# Altium project Isolated Gate Driver Bias Supply.PrjPcb
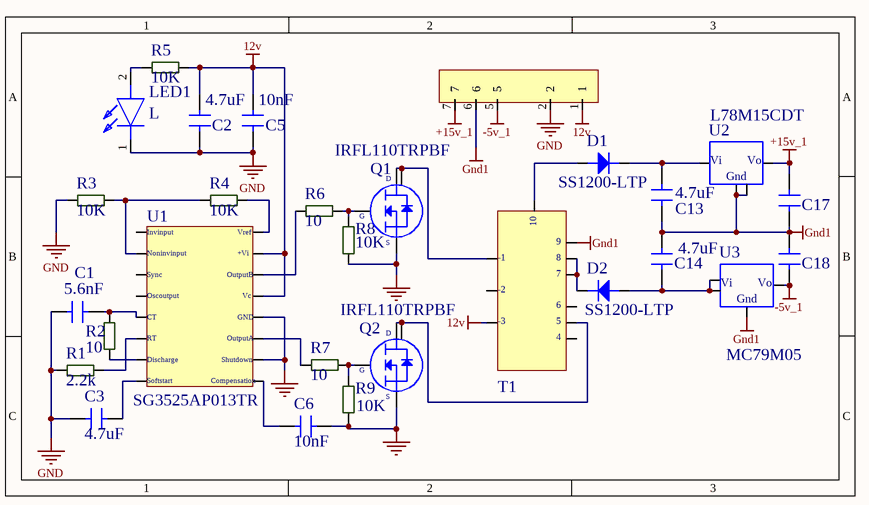
[diagram p0: Isolated Gate Driver Bias Supply Schematic.SchDoc]
1 sheet, 28 parts. Net scope: global (net labels, ports and power ports of the same name join across sheets).
Board file: Isolated Gate Driver Bias Supply PCB.PcbDoc

## Sheet Isolated Gate Driver Bias Supply Schematic.SchDoc
size 160 x 90 mm

### Parts
7  7  [SIP7]  (value not drawn)
C1  5.6nF  [Cap1206]
C2  4.7uF  [Cap1206]
C3  4.7uF  [Cap1206]
C5  10nF  [Cap1206]
C6  10nF  [Cap1206]
C13  4.7uF  [Cap1206]
C14  4.7uF  [Cap1206]
C17  CL31A106KBHNNNE  [Cap1206]  (value not drawn)
C18  CL31A106KBHNNNE  [Cap1206]  (value not drawn)
D1  SS1200-LTP  [DO-214AC]
D2  SS1200-LTP  [DO-214AC]
LED1  L  [L-1206]
Q1  IRFL110TRPBF  [SOT223]
Q2  IRFL110TRPBF  [SOT223]
R1  2.2k  [RES1206]
R2  10  [RES1206]
R3  10K  [RES1206]
R4  10K  [RES1206]
R5  10K  [RES1206]
R6  10  [RES1206]
R7  10  [RES1206]
R8  10K  [RES1206]
R9  10K  [RES1206]
T1  EE2006Transformer  [EE2006]  (value not drawn)
U1  SG3525AP013TR  [SOIC16N SG3525]
U2  L78M15CDT  [sot89]
U3  MC79M05  [sot89]

### Nets
12v: 7.1 C2.1 C5.1 R5.1 T1.3 U1.13 U1.15
+15v_1: 7.7 C17.1 U2.1
-5v_1: 7.5 C18.2 U3.3
GND: 7.2 C1.2 C2.2 C3.1 C5.2 C6.1 LED1.1(K) Q1.3 Q2.3 R1.1 R3.2 R8.1 R9.2 U1.10 U1.12
Gnd1: 7.6 C13.2 C14.1 C17.2 C18.1 T1.9 U2.2 U2.4 U3.1
NetC1_1: C1.1 R2.1 U1.5
NetC3_2: C3.2 U1.8
NetC6_2: C6.2 U1.9
NetC13_1: C13.1 D1.k U2.3
NetC14_2: C14.2 D2.a U3.2
NetD1_a: D1.a T1.10
NetD2_k: D2.k T1.7 T1.8
NetLED1_2: LED1.2(A) R5.2
NetQ1_1: Q1.1 R6.1 R8.2
NetQ1_2: Q1.2 Q1.4 T1.1
NetQ2_1: Q2.1 R7.1 R9.1
NetQ2_2: Q2.2 Q2.4 T1.5
NetR1_2: R1.2 U1.6
NetR2_2: R2.2 U1.7
NetR3_1: R3.1 R4.2 U1.2
NetR4_1: R4.1 U1.16
NetR6_2: R6.2 U1.14
NetR7_2: R7.2 U1.11

Not connected (* = marked no-connect by the designer): T1 2 4 6; U1 1 3 4

### Notes on the sheet
- Title
- Size:
- Date:
- A
- Number:
- Time:
- Revision:
- Sheet
- of
- File:
- (in symbol EE2006Transformer) -1; -2; -3
- (in symbol IRFL110TRPBF) Text; D; G; S
- (in symbol L78M15CDT) Vi; Vo; Gnd
- (in symbol MC79M05CDTRKG) Vi; Vo; Gnd
- (in symbol SG3525AP013TR) Invinput; Vref; Noninvinput; +Vi; Sync; OutputB; Oscoutput; Vc; CT; GND; RT; OutputA; Discharge; Shutdown; Softstart; Compensation

### Library data of the parts
7 = sip7
C1-C3 C5 C6 C13 C14 C17 C18 = CL31A106KBHNNNE: Cap Ceramic 10uF 50V X5R 10% SMD 1206 85C T/R; Manufacturer: Samsung; Supplier 1: Digi-Key; Manufacturer Part Number: CL31A106KBHNNNE; RoHS: Yes; Stock 1: 482000; Pricing 1: 2000 = 0,17875, 4000 = 0,16758 (USD); Mount: Surface Mount; Case/Package: 1206; Case Code (Metric): 3216; Case Code (Imperial): 1206; Material: Ceramic; Contact Plating: Tin; Min Operating Temperature: -55°C; Max Operating Temperature: 85°C; Capacitance: 10uF; Tolerance: 10%; Package Quantity: 1; Packaging: Tape and Reel; Voltage Rating: 50V; Dielectric: X5R; Voltage Rating (DC): 50V; Length: 3.2mm; Height: 1.6mm; Width: 0.063inch; Thickness: 0.071inch; Depth: 1.6mm; Radiation Hardening: No; Lead Free: Lead Free; ComponentLink1URL: https://media.digikey.com/pdf/Data%20Sheets/Samsung%20PDFs/CL_Series_MLCC_ds.pdf?src-supplier=Digi-Key; ComponentLink1Description: https://media.digikey.com/pdf/Data%20Sheets/Samsung%20PDFs/CL_Series_MLCC_ds.pdf?src-supplier=Digi-Key; ComponentLink2URL: http://www1.futureelectronics.com/doc/SAMSUNG%20PASSIVE/CL05B104KQ5NNNC.pdf?src-supplier=Future+Electronics; ComponentLink2Description: http://www1.futureelectronics.com/doc/SAMSUNG%20PASSIVE/CL05B104KQ5NNNC.pdf?src-supplier=Future+Electronics; ComponentLink3URL: http://www.rapidonline.com/pdf/71-0881.pdf?src-supplier=Rapid+Electronics; ComponentLink3Description: http://www.rapidonline.com/pdf/71-0881.pdf?src-supplier=Rapid+Electronics; ComponentLink4URL: https://www.verical.com/server-webapp/html/getDatasheet?partID=353196&src-supplier=Verical; ComponentLink4Description: https://www.verical.com/server-webapp/html/getDatasheet?partID=353196&src-supplier=Verical; ComponentLink5URL: https://produktinfo.conrad.com/datenblaetter/450000-474999/452492-da-01-en-VS_KONDENSATOR_1206.pdf?src-supplier=Conrad; ComponentLink5Description: https://produktinfo.conrad.com/datenblaetter/450000-474999/452492-da-01-en-VS_KONDENSATOR_1206.pdf?src-supplier=Conrad; Supplier Part Number 1: 1276-2876-2-ND
D1 D2 = SS1200-LTP: DIODE SCHOTTKY 200V 1A DO214AC; Manufacturer: MCC; Max Surge Current: 30A; Forward Voltage: 920mV; Peak Reverse Current: 1mA; Element Configuration: Single; Supplier 1: Digi-Key; Manufacturer Part Number: SS1200-LTP; RoHS: Yes; Stock 1: 10000; Pricing 1: 5000 = 0,09300, 10000 = 0,08700, 25000 = 0,08400 (USD); Mount: Surface Mount; Min Operating Temperature: -55°C; Max Operating Temperature: 150°C; Packaging: Tape and Reel; Package Quantity: 1; Max Reverse Leakage Current: 1mA; Max Repetitive Reverse Voltage (Vrrm): 200V; Forward Current: 1A; Max Forward Surge Current (Ifsm): 30A; Average Rectified Current: 1A; Max Reverse Voltage (DC): 200V; Lead Free: Lead Free; ComponentLink1URL: https://datasheet.ciiva.com/913/ss1150-l-ss1200-ldo-214ac-913194.pdf?src-supplier=Digi-Key; ComponentLink1Description: https://datasheet.ciiva.com/913/ss1150-l-ss1200-ldo-214ac-913194.pdf?src-supplier=Digi-Key; ComponentLink2URL: https://datasheet.ciiva.com/15404/ss1150-l-ss1200-ldo-214ac-272760-15404740.pdf?src-supplier=Mouser; ComponentLink2Description: https://datasheet.ciiva.com/15404/ss1150-l-ss1200-ldo-214ac-272760-15404740.pdf?src-supplier=Mouser; ComponentLink3URL: https://datasheet.ciiva.com/913/ss1150-l-ss1200-ldo-214ac-913195.pdf?src-supplier=Digi-Key; ComponentLink3Description: https://datasheet.ciiva.com/913/ss1150-l-ss1200-ldo-214ac-913195.pdf?src-supplier=Digi-Key; ComponentLink4URL: https://datasheet.ciiva.com/913/ss1150-l-ss1200-ldo-214ac-913196.pdf?src-supplier=Digi-Key; ComponentLink4Description: https://datasheet.ciiva.com/913/ss1150-l-ss1200-ldo-214ac-913196.pdf?src-supplier=Digi-Key; ComponentLink5URL: https://datasheet.ciiva.com/17447/ss1150-l-ss1200-ldo-214ac-17447695.pdf?src-supplier=Future+Electronics; ComponentLink5Description: https://datasheet.ciiva.com/17447/ss1150-l-ss1200-ldo-214ac-17447695.pdf?src-supplier=Future+Electronics; Supplier Part Number 1: SS1200-LTPMSTR-ND
LED1 = LTST-C150KGKT: LED; Manufacturer_Name: Lite-On; Datasheet Link: http://optoelectronics.liteon.com/upload/download/ds22-2000-072/ltst-c150kgkt.pdf; Height: 1.2mm; Manufacturer_Part_Number: LTST-C150KGKT; Mouser Part Number: 859-LTST-C150KGKT; Mouser Price/Stock: https://www.mouser.com/Search/Refine.aspx?Keyword=859-LTST-C150KGKT; RS Part Number: 6920871; RS Price/Stock: https://uk.rs-online.com/web/p/products/6920871
Q1 Q2 = IRFL110TRPBF: Trans MOSFET N-CH 100V 1.5A 4-Pin(3+Tab) T/R; Manufacturer: Vishay; Input Capacitance: 180pF; Number of Elements: 1; Max Power Dissipation: 2W; Rds On Max: 540mR; Rise Time: 16ns; Gate to Source Voltage (Vgs): 20V; Fall Time: 9.4ns; Turn-Off Delay Time: 15ns; Turn-On Delay Time: 6.9ns; Element Configuration: Single; Current: 15A; Supplier 1: Digi-Key; Manufacturer Part Number: IRFL110TRPBF; RoHS: Yes; Stock 1: 5000; Pricing 1: 2500 = 0,29779 (USD); Mount: Surface Mount; Case/Package: SOT-223; Number of Pins: 3; Weight: 0.008826oz; Contact Plating: Matte,Tin; Min Operating Temperature: -55°C; Max Operating Temperature: 150°C; Package Quantity: 1; Packaging: Tape and Reel; Drain to Source Voltage (Vdss): 100V; Continuous Drain Current (ID): 1.5A; Drain to Source Breakdown Voltage: 100V; Drain to Source Resistance: 540mR; Power Dissipation: 2W; Number of Channels: 1; Voltage: 100V; On-State Resistance: 540mR; Length: 6.7mm; Height: 1.8mm; Width: 3.7mm; Radiation Hardening: No; REACH SVHC: Unknown; Lead Free: Lead Free; ComponentLink1URL: http://www.vishay.com/docs/91192/sihfl110.pdf?src-supplier=Avnet; ComponentLink1Description: http://www.vishay.com/docs/91192/sihfl110.pdf?src-supplier=Avnet; ComponentLink2URL: http://www.vishay.com/docs/91192/sihfl110.pdf?src-supplier=Future+Electronics; ComponentLink2Description: http://www.vishay.com/docs/91192/sihfl110.pdf?src-supplier=Future+Electronics; ComponentLink3URL: http://www.vishay.com/docs/91192/sihfl110.pdf?src-supplier=Avnet+Europe; ComponentLink3Description: http://www.vishay.com/docs/91192/sihfl110.pdf?src-supplier=Avnet+Europe; ComponentLink4URL: https://www.verical.com/server-webapp/html/getDatasheet?partID=80948&src-supplier=Verical; ComponentLink4Description: https://www.verical.com/server-webapp/html/getDatasheet?partID=80948&src-supplier=Verical; ComponentLink5URL: http://www.vishay.com/docs/91192/sihfl110.pdf?src-supplier=Digi-Key; ComponentLink5Description: http://www.vishay.com/docs/91192/sihfl110.pdf?src-supplier=Digi-Key; ComponentLink6URL: http://uk.rs-online.com/webdocs/126c/0900766b8126cec6.pdf?src-supplier=RSComponents; ComponentLink6Description: http://uk.rs-online.com/webdocs/126c/0900766b8126cec6.pdf?src-supplier=RSComponents; ComponentLink7URL: http://www.jameco.com/Jameco/Products/ProdDS/1562152.pdf?src-supplier=Jameco; ComponentLink7Description: http://www.jameco.com/Jameco/Products/ProdDS/1562152.pdf?src-supplier=Jameco; ComponentLink8URL: http://datasheet.iiic.cc/vishay_[siliconix]/IRFL110TRPBF.pdf?src-supplier=IIIC; ComponentLink8Description: http://datasheet.iiic.cc/vishay_[siliconix]/IRFL110TRPBF.pdf?src-supplier=IIIC; Supplier Part Number 1: IRFL110PBFTR-ND
R1-R9 = RMCF1206ZT0R00: RES 0 OHM JUMPER 1/4W 1206; Manufacturer: Stackpole Electronics; Resistance: 0mR; Power Rating: 250mW; Current Rating: 2A; Working Voltage: 200V; Supplier 1: Digi-Key; Manufacturer Part Number: RMCF1206ZT0R00; RoHS: Yes; Stock 1: 1700000; Pricing 1: 5000 = 0,00355, 10000 = 0,00309, 25000 = 0,00271, 50000 = 0,00249, 125000 = 0,00244 (USD); Mount: Surface Mount; Case/Package: 1206; Case Code (Metric): 3216; Case Code (Imperial): 1206; Contact Plating: Matte,Tin; Min Operating Temperature: -55°C; Max Operating Temperature: 155°C; Packaging: Tape and Reel; Composition: Thick Film; Number of Terminations: 2; Military Standard: Not; Max Power Dissipation: 250mW; Features: Automotive AEC-Q200; Length: 0.126inch; Height: 0.028inch; Width: 0.063inch; Depth: 1.6mm; Radiation Hardening: No; Lead Free: Lead Free; Supplier Part Number 1: RMCF1206ZT0R00TR-ND
U1 = SG3525AP013TR: IC REG CTRLR BCK/PSH-PULL 16SOIC; Manufacturer: STMicroelectronics; Max Supply Voltage: 35V; Output Current: 400A; Rise Time: 100ns; Number of Outputs: 2; Switching Frequency: 400kHz; Output Voltage: 5.2V; Max Frequency: 500kHz; Duty Cycle: 49%; Fall Time: 50ns; Operating Supply Current: 14mA; Max Supply Current: 20mA; Supplier 1: Digi-Key; RoHS: Yes; Stock 1: 5712; Pricing 1: 1 = 1,58000, 10 = 1,41600, 100 = 1,10400, 500 = 0,91196, 1000 = 0,71997 (USD); Mount: Surface Mount; Number of Pins: 16; Weight: 0.007079oz; Min Operating Temperature: 0°C; Max Operating Temperature: 70°C; Packaging: Tape and Reel; Package Quantity: 1; Max Duty Cycle: 49%; Radiation Hardening: No; Lead Free: Lead Free; ComponentLink1URL: http://www.st.com/content/ccc/resource/technical/document/datasheet/c0/12/98/4a/3b/1a/4b/8b/CD00000958.pdf/files/CD00000958.pdf/jcr:content/translations/en.CD00000958.pdf?src-supplier=Digi-Key; ComponentLink1Description: http://www.st.com/content/ccc/resource/technical/document/datasheet/c0/12/98/4a/3b/1a/4b/8b/CD00000958.pdf/files/CD00000958.pdf/jcr:content/translations/en.CD00000958.pdf?src-supplier=Digi-Key; ComponentLink2URL: https://www.verical.com/server-webapp/html/getDatasheet?partID=376579&src-supplier=Verical; ComponentLink2Description: https://www.verical.com/server-webapp/html/getDatasheet?partID=376579&src-supplier=Verical; ComponentLink3URL: http://www.produktinfo.conrad.com/datenblaetter/1100000-1199999/001185611-da-01-en-IC_REG_CTRLR_P_SG3525AP013TR_SOIC_16_STM.pdf?src-supplier=Conrad; ComponentLink3Description: http://www.produktinfo.conrad.com/datenblaetter/1100000-1199999/001185611-da-01-en-IC_REG_CTRLR_P_SG3525AP013TR_SOIC_16_STM.pdf?src-supplier=Conrad; Case/Package: SOIC; Supplier Part Number 1: 497-6479-1-ND; Manufacturer Part Number: SG3525AP013TR
U2 = L78M15CDT: Linear Voltage Regulators 15V 0.5A Positive; Manufacturer: STMicroelectronics; Max Output Current: 500mA; Number of Outputs: 1; Max Input Voltage: 35V; Quiescent Current: 6mA; Output Type: Fixed; Dropout Voltage: 2V; Supplier 1: Avnet; Manufacturer Part Number: L78M15CDT; RoHS: Yes; Mount: Surface Mount; Case/Package: DPAK; Number of Pins: 3; Min Operating Temperature: 0°C; Max Operating Temperature: 150°C; Output Voltage: 15V; Polarity: Positive; Packaging: Rail/Tube; Output Current: 500mA; Min Input Voltage: 35V; Package Quantity: 75; Length: 6.6mm; Height: 2.4mm; Width: 6.2mm; Radiation Hardening: No; ComponentLink1URL: http://docs-usa.electrocomponents.com/techlib:/itc_doclist_US.htm?stockno=1890999&src-supplier=Allied+Electronics; ComponentLink1Description: http://docs-usa.electrocomponents.com/techlib:/itc_doclist_US.htm?stockno=1890999&src-supplier=Allied+Electronics; ComponentLink2URL: http://www.st.com/web/en/resource/technical/document/datasheet/CD00000447.pdf?src-supplier=Avnet+Europe; ComponentLink2Description: http://www.st.com/web/en/resource/technical/document/datasheet/CD00000447.pdf?src-supplier=Avnet+Europe; ComponentLink3URL: http://www.mouser.com/ds/2/389/stmicroelectronics_cd00000447-329548.pdf?src-supplier=Mouser; ComponentLink3Description: http://www.mouser.com/ds/2/389/stmicroelectronics_cd00000447-329548.pdf?src-supplier=Mouser; Supplier Part Number 1: L78M15CDT
U3 = MC79M05CDTRKG: ON SEMICONDUCTOR - MC79M05CDTRKG - NEGATIVE VOLTAGE REGULATOR, -5V, DPAK-3; Max Input Voltage: -35V; Min Input Voltage: -7V; Max Output Current: 500mA; Number of Outputs: 1; Dropout Voltage: 1.1V; Accuracy: 4%; Max Output Voltage: -5.2V; Power Supply Rejection Ratio (PSRR): 66dB; Output Type: Fixed; Supplier 1: Digi-Key; Manufacturer: ON Semiconductor; Manufacturer Part Number: MC79M05CDTRKG; RoHS: Yes; Stock 1: 5000; Pricing 1: 2500 = 0,18538, 5000 = 0,17342, 12500 = 0,16146, 25000 = 0,15309, 62500 = 0,14950 (USD); Mount: Surface Mount; Case/Package: DPAK; Number of Pins: 3; Contact Plating: Matte,Tin; Min Operating Temperature: 0°C; Max Operating Temperature: 125°C; Packaging: Tape and Reel; Output Voltage: -5V; Output Current: 500mA; Nominal Output Voltage: -5V; Package Quantity: 1; Number of Regulators: 1; Polarity: Negative; Min Output Voltage: -5V; Output Voltage Accuracy: 4%; Length: 6.73mm; Height: 2.38mm; Width: 6.22mm; Radiation Hardening: No; REACH SVHC: No SVHC; Lead Free: Lead Free; Halogen Free: Halogen Free; ComponentLink1URL: http://www.farnell.com/datasheets/2236912.pdf?src-supplier=Newark; ComponentLink1Description: http://www.farnell.com/datasheets/2236912.pdf?src-supplier=Newark; ComponentLink2URL: http://www.onsemi.com/pub/Collateral/MC79M00-D.PDF?src-supplier=Digi-Key; ComponentLink2Description: http://www.onsemi.com/pub/Collateral/MC79M00-D.PDF?src-supplier=Digi-Key; ComponentLink3URL: http://www.farnell.com/datasheets/1747960.pdf?src-supplier=Element14; ComponentLink3Description: http://www.farnell.com/datasheets/1747960.pdf?src-supplier=Element14; ComponentLink4URL: http://www.onsemi.com/pub/Collateral/MC79M00-D.PDF?src-supplier=Avnet+Europe; ComponentLink4Description: http://www.onsemi.com/pub/Collateral/MC79M00-D.PDF?src-supplier=Avnet+Europe; Supplier Part Number 1: MC79M05CDTRKGOSTR-ND